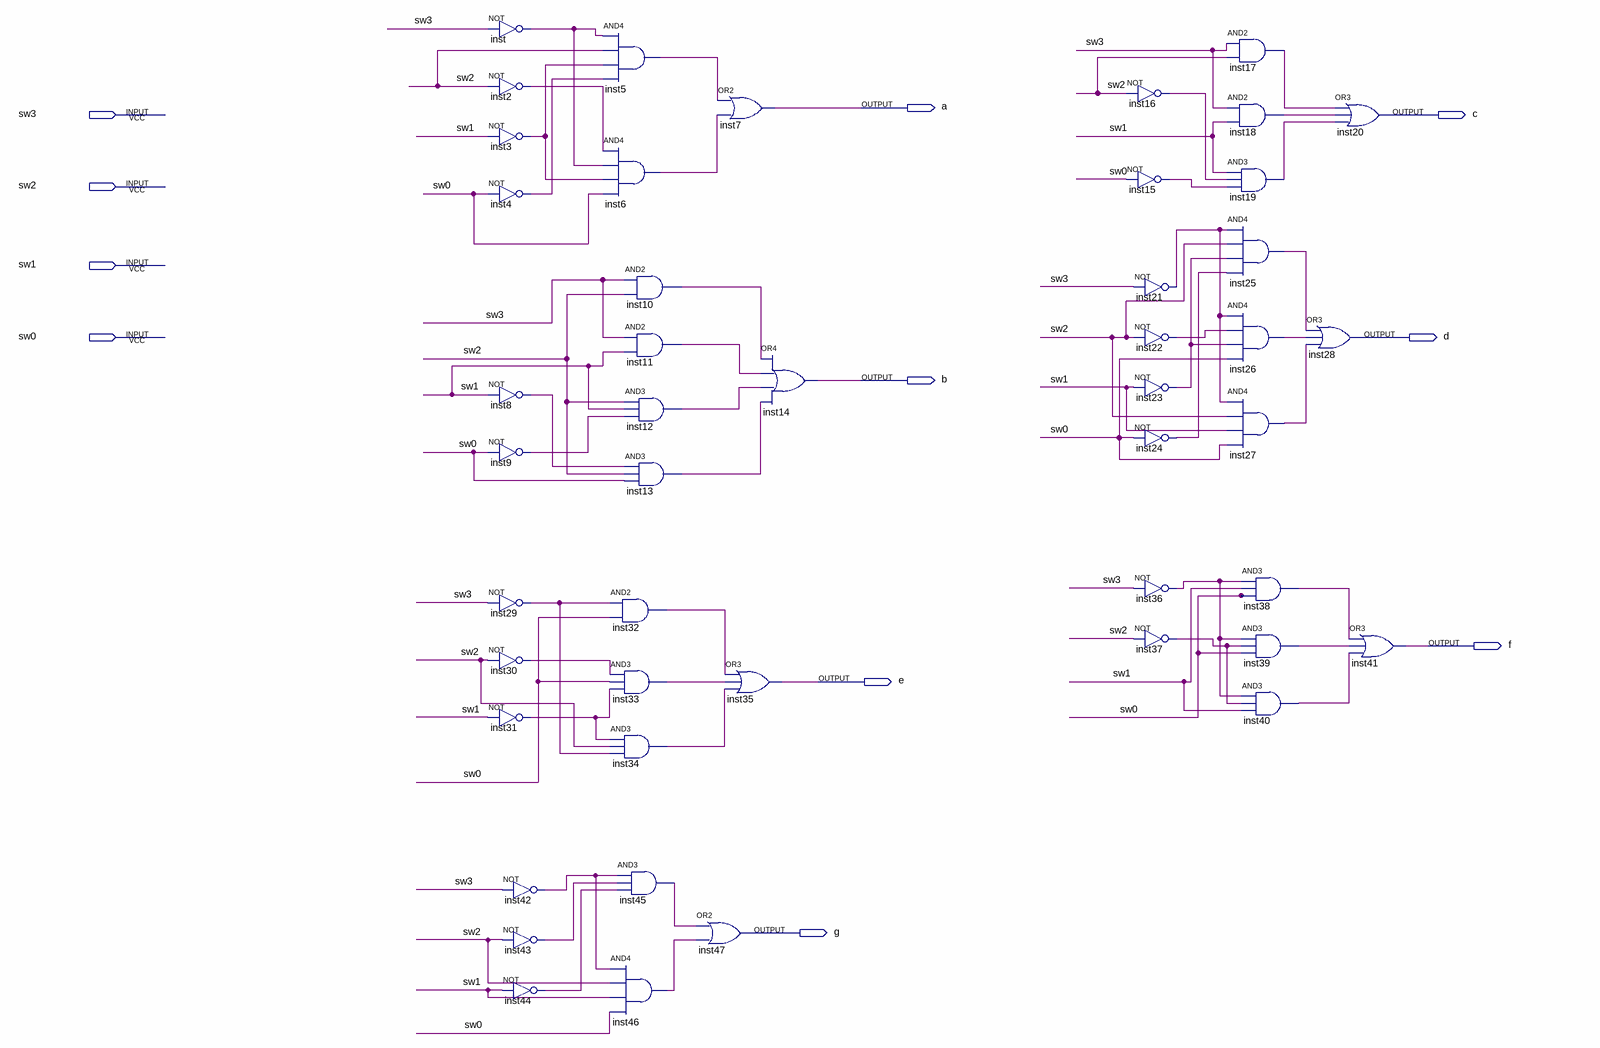
[diagram p0: schematic sheet]
// Quartus schematic dom1.bdf as structural Verilog: 47 symbols, 11 pins
module dom1 (
  input  sw3,
  input  sw2,
  input  sw1,
  input  sw0,
  output a,
  output c,
  output d,
  output b,
  output f,
  output e,
  output g
);

  wire inst2_out, inst3_out, inst4_out, inst5_out, inst6_out, inst8_out, inst9_out, inst10_out, inst11_out,
       inst12_out, inst13_out, inst15_out, inst16_out, inst17_out, inst18_out, inst19_out, inst21_out,
       inst22_out, inst23_out, inst24_out, inst25_out, inst26_out, inst27_out, inst29_out, inst30_out,
       inst31_out, inst32_out, inst33_out, inst34_out, inst36_out, inst37_out, inst38_out, inst39_out,
       inst40_out, inst42_out, inst43_out, inst44_out, inst45_out, inst46_out, inst_out;

  not inst (inst_out, sw3);
  not inst2 (inst2_out, sw2);
  not inst3 (inst3_out, sw1);
  not inst4 (inst4_out, sw0);
  not inst8 (inst8_out, sw1);
  not inst9 (inst9_out, sw0);
  not inst29 (inst29_out, sw3);
  not inst30 (inst30_out, sw2);
  not inst31 (inst31_out, sw1);
  not inst42 (inst42_out, sw3);
  not inst43 (inst43_out, sw2);
  not inst44 (inst44_out, sw1);
  and inst5 (inst5_out, inst_out, sw2, inst3_out, inst4_out);
  and inst6 (inst6_out, inst2_out, inst_out, inst3_out, sw0);
  and inst32 (inst32_out, inst29_out, sw0);
  and inst33 (inst33_out, inst30_out, sw0, inst31_out);
  and inst34 (inst34_out, inst31_out, sw2, inst29_out);
  and inst46 (inst46_out, inst42_out, sw2, sw1, sw0);
  and inst10 (inst10_out, sw3, sw2);
  and inst11 (inst11_out, sw3, sw1);
  and inst12 (inst12_out, sw2, sw1, inst9_out);
  and inst13 (inst13_out, inst8_out, sw2, sw0);
  and inst45 (inst45_out, inst42_out, inst43_out, inst44_out);
  or inst7 (a, inst5_out, inst6_out);
  or inst35 (e, inst32_out, inst33_out, inst34_out);
  or inst47 (g, inst45_out, inst46_out);
  or inst14 (b, inst10_out, inst11_out, inst12_out, inst13_out);
  not inst16 (inst16_out, sw2);
  not inst15 (inst15_out, sw0);
  not inst21 (inst21_out, sw3);
  not inst22 (inst22_out, sw2);
  not inst23 (inst23_out, sw1);
  not inst24 (inst24_out, sw0);
  not inst36 (inst36_out, sw3);
  not inst37 (inst37_out, sw2);
  and inst17 (inst17_out, sw3, sw2);
  and inst18 (inst18_out, sw3, sw1);
  and inst19 (inst19_out, sw1, inst16_out, inst15_out);
  and inst25 (inst25_out, inst21_out, sw2, inst23_out, inst24_out);
  and inst26 (inst26_out, inst21_out, inst22_out, inst23_out, sw0);
  and inst27 (inst27_out, inst21_out, sw2, sw1, sw0);
  and inst38 (inst38_out, inst36_out, sw1, sw0);
  and inst39 (inst39_out, inst36_out, inst37_out, sw0);
  and inst40 (inst40_out, inst36_out, inst37_out, sw1);
  or inst20 (c, inst17_out, inst18_out, inst19_out);
  or inst28 (d, inst25_out, inst26_out, inst27_out);
  or inst41 (f, inst38_out, inst39_out, inst40_out);
endmodule
